# Altium schematic sheet CodeWithJawad-eee_MPU6050__MPU6050.SchDoc
size A; SheetNumber: 1; SheetTotal: 1
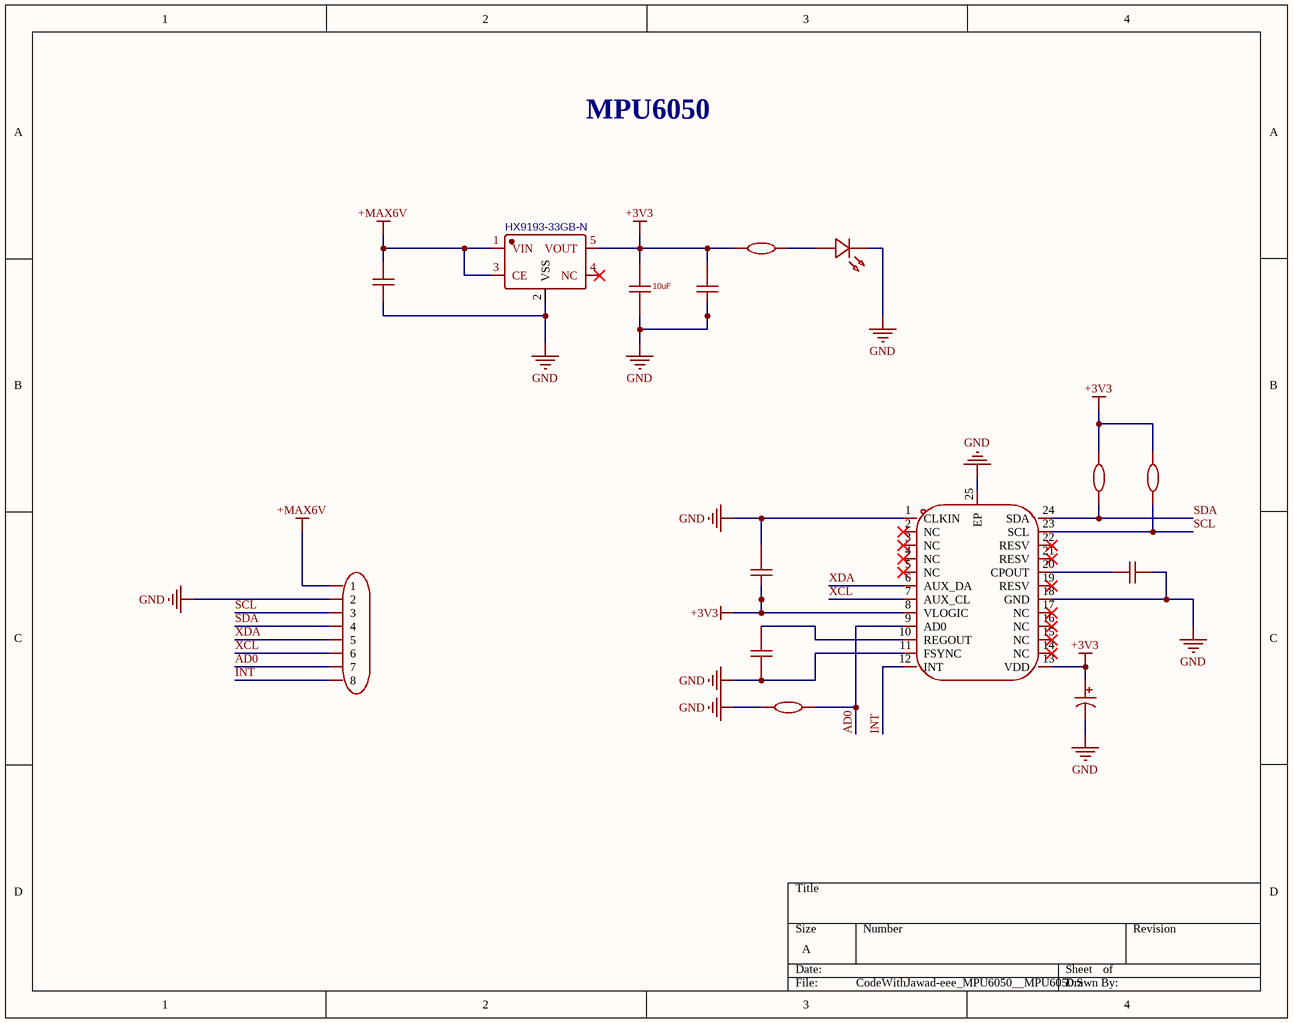
[diagram p0: CodeWithJawad-eee_MPU6050__MPU6050.SchDoc]

## Parts
C1  100nF  [C0603]  (value not drawn)
C2  10uF  [C0603]
C3  4.7uF  [C0603]  (value not drawn)
C4  2.2nF  [C0603]  (value not drawn)
C5  100nF  [CAP-TH_BD5.0-P2.00-D0.8-FD]  (value not drawn)
C6  100nF  [C0603]  (value not drawn)
C7  100nF  [C0603]  (value not drawn)
LED1  XL-1608SURC-06  [LED0603-RD_RED]  (value not drawn)
P1  2.54-1*8P母环保  [HDR-TH_8P-P2.54-V-F-1]  (value not drawn)
R1  2kΩ  [R0603]  (value not drawn)
R2  4.7kΩ  [R0603]  (value not drawn)
R3  4.7kΩ  [R0603]  (value not drawn)
R4  4.7kΩ  [R0603]  (value not drawn)
U1  HX9193-33GB-N  [SOT-23-5_L2.9-W1.6-P0.95-LS2.8-BL]
U3  MPU-6050  [QFN-24_L4.0-W4.0-P0.50-BL-EP2.7]  (value not drawn)

## Nets
+3V3: C1.2 C2.2 C5.1 C6.1 R1.1 R2.2 R3.2 U1.5(VOUT) U3.8(VLOGIC) U3.13(VDD)
+MAX6V: C3.2 P1.1 U1.1(VIN) U1.3(CE)
GND: C1.1 C2.1 C3.1 C4.2 C5.2 C6.2 C7.1 LED1.1(K) P1.2 R4.2 U1.2(VSS) U3.1(CLKIN) U3.11(FSYNC) U3.18(GND) U3.25(EP)
AD0: P1.7 R4.1 U3.9(AD0)
INT: P1.8 U3.12(INT)
SCL: P1.3 R3.1 U3.23(SCL)
SDA: P1.4 R2.1 U3.24(SDA)
XCL: P1.6 U3.7(AUX_CL)
XDA: P1.5 U3.6(AUX_DA)
NetC4_1: C4.1 U3.20(CPOUT)
NetC7_2: C7.2 U3.10(REGOUT)
NetLED1_2: LED1.2(A) R1.2

Not connected (* = marked no-connect by the designer): U1 4(NC)*; U3 2(NC)* 3(NC)* 4(NC)* 5(NC)* 14(NC)* 15(NC)* 16(NC)* 17(NC)* 19(RESV)* 21(RESV)* 22(RESV)*

## Notes on the sheet
- MPU6050

## Library data of the parts
C1 C6 C7 = CC0603KRX7R9BB104: Manufacturer: YAGEO(国巨); Add into BOM: yes; Tolerance: ±10%; Symbol: CC0603KRX7R9BB104; Device: CC0603KRX7R9BB104; LCSC Part Name: 100nF ±10% 50V; Supplier Part: C14663; Manufacturer Part: CC0603KRX7R9BB104; Supplier Footprint: 0603; JLCPCB Part Class: Basic Part; Datasheet: https://atta.szlcsc.com/upload/public/pdf/source/20180910/C282072_33301C7F631E79921B82A8DAC6BCC5B3.pdf; Supplier: LCSC; Convert to PCB: yes; Value: 100nF
C2 = CL10A106KP8NNNC: Manufacturer: SAMSUNG(三星); Add into BOM: yes; Tolerance: ±10%; Symbol: CL10A106KP8NNNC; Device: CL10A106KP8NNNC; LCSC Part Name: 10uF ±10% 10V; Supplier Part: C19702; Manufacturer Part: CL10A106KP8NNNC; Supplier Footprint: 0603; JLCPCB Part Class: Basic Part; Datasheet: https://atta.szlcsc.com/upload/public/pdf/source/20160218/1457707763339.pdf; Supplier: LCSC; Convert to PCB: yes; Value: 10uF
C3 = CL10A475KA8NQNC: Manufacturer: SAMSUNG(三星); Add into BOM: yes; Tolerance: ±10%; Symbol: CL10A475KA8NQNC; Device: CL10A475KA8NQNC; LCSC Part Name: 4.7uF ±10% 25V; Supplier Part: C69335; Manufacturer Part: CL10A475KA8NQNC; Supplier Footprint: 0603; JLCPCB Part Class: Extended Part; Datasheet: https://atta.szlcsc.com/upload/public/pdf/source/20161108/1478586410580.pdf; Supplier: LCSC; Convert to PCB: yes; Value: 4.7uF
C4 = CC0603KRX7R9BB222: Manufacturer: YAGEO(国巨); Add into BOM: yes; Tolerance: ±10%; Symbol: CC0603KRX7R9BB222; Device: CC0603KRX7R9BB222; LCSC Part Name: 2.2nF ±10% 50V; Supplier Part: C107082; Manufacturer Part: CC0603KRX7R9BB222; Supplier Footprint: 0603; JLCPCB Part Class: Extended Part; Datasheet: https://atta.szlcsc.com/upload/public/pdf/source/20180910/C282072_33301C7F631E79921B82A8DAC6BCC5B3.pdf; Supplier: LCSC; Convert to PCB: yes; Value: 2.2nF
C5 = KM104M050D11RR0VH2FP0: Manufacturer: CX(承兴); Symbol: 0.1UF 50V; Add into BOM: yes; Tolerance: ±20%; Lifetime @ Temp: 1000hrs@105℃; Device: KM104M050D11RR0VH2FP0; LCSC Part Name: 100nF ±20% 50V; Supplier Part: C28061; Manufacturer Part: KM104M050D11RR0VH2FP0; Supplier Footprint: 插件,D5xL11mm; JLCPCB Part Class: Extended Part; Datasheet: https://atta.szlcsc.com/upload/public/pdf/source/20211027/06D6BA3719C264B639DC286D935D03EA.pdf; Supplier: LCSC; Convert to PCB: yes; Value: 100nF
LED1 = XL-1608SURC-06: Manufacturer: XINGLIGHT(成兴光); Add into BOM: yes; Illumination Color: Red; Voltage - Forward(Vf): 2.3V; Power(Watts): 50mW; Forward Current: 20mA; Wavelength - Dominant: 620nm~630nm; Peak Wavelength: 625nm; Lens Color: Colorless Transparent Lens; Luminous Intensity: 225mcd; Viewing Angle: 120°; Mounting Sytle: Positive Stick; Symbol: XL-1608SURC-06; Device: XL-1608SURC-06; LCSC Part Name: XL-1608SURC-06; Supplier Part: C965799; Manufacturer Part: XL-1608SURC-06; Supplier Footprint: 0603; JLCPCB Part Class: Extended Part; Datasheet: https://atta.szlcsc.com/upload/public/pdf/source/20250213/F9766CE804AF391355DCDD48DB3E0DAB.pdf; Supplier: LCSC; Convert to PCB: yes; Lamp Holder Type: -; Diode Configuration: -; Color Temperature: -; Operating Temperature: -20℃~+85℃
P1 = 2.54-1*8P母环保: Manufacturer: BOOMELE(博穆精密); Symbol: Header-Female-2.54_1x8; Add into BOM: yes; Holes Structure: 1x8P; Pitch: 2.54mm; Number of Holes: 8P; Device: 2.54-1*8P母环保; LCSC Part Name: 间距:2.54mm 1x8P 直插; Supplier Part: C27438; Manufacturer Part: 2.54-1*8P母环保; Supplier Footprint: 插件,P=2.54mm; JLCPCB Part Class: Extended Part; Datasheet: https://atta.szlcsc.com/upload/public/pdf/source/20231221/1CA800C6799ED97958773716FAA1BFFE.pdf; Supplier: LCSC; Convert to PCB: yes; Row Spacing: -; Mounting Type: Straight; Number of Rows: Plugin; Insulation Height: -; Contact Material: -; Contact Plating: -
R1 = RC0603FR-072KL: Manufacturer: YAGEO(国巨); Add into BOM: yes; Tolerance: ±1%; Power(Watts): 100mW; Voltage-Supply(Max): 75V; Temperature Coefficient: ±100ppm/℃; Symbol: RC0603FR-072KL; Device: RC0603FR-072KL; LCSC Part Name: 厚膜电阻 2kΩ ±1% 100mW; Supplier Part: C105576; Manufacturer Part: RC0603FR-072KL; Supplier Footprint: 0603; JLCPCB Part Class: Extended Part; Datasheet: https://atta.szlcsc.com/upload/public/pdf/source/20180316/70C0E2BDAE7FCC62C531A5A58D202EE1.pdf; Supplier: LCSC; Convert to PCB: yes; Type: Thick Film Resistors; Value: 2kΩ; Operating Temperature: -55℃~+155℃
R2-R4 = RC0603FR-074K7L: Manufacturer: YAGEO(国巨); Add into BOM: yes; Tolerance: ±1%; Temperature Coefficient: ±100ppm/℃; Symbol: RC0603FR-074K7L; Device: RC0603FR-074K7L; LCSC Part Name: 厚膜电阻 4.7kΩ ±1% 100mW; Supplier Part: C99782; Manufacturer Part: RC0603FR-074K7L; Supplier Footprint: 0603; JLCPCB Part Class: Extended Part; Datasheet: https://atta.szlcsc.com/upload/public/pdf/source/20180224/C181757_15194369480721363983.pdf; Supplier: LCSC; Convert to PCB: yes; Type: Thick Film Resistors; Value: 4.7kΩ; Operating Temperature Range: -55℃~+155℃
U1 = HX9193-33GB-N: Manufacturer: HX(恒佳兴); Contributor: lcsc; Supplier: LCSC; Supplier Part: C2995655; Manufacturer Part: HX9193-33GB-N; JLCPCB Part Class: Extended Part; spicePre: U; spiceSymbolName: HX9193-33GB-N
U3 = MPU-6050: Manufacturer: TDK InvenSense(应美盛); Symbol: MPU-6050_C24112; Add into BOM: yes; Sensor Type: 加速度计陀螺仪; Device: MPU-6050; LCSC Part Name: MPU-6050; Supplier Part: C24112; Manufacturer Part: MPU-6050; Supplier Footprint: QFN-24-EP(4x4); JLCPCB Part Class: Extended Part; Datasheet: https://atta.szlcsc.com/upload/public/pdf/source/20140425/1457707046159.pdf; Supplier: LCSC; Convert to PCB: yes; Operating Temperature: -40℃~+85℃